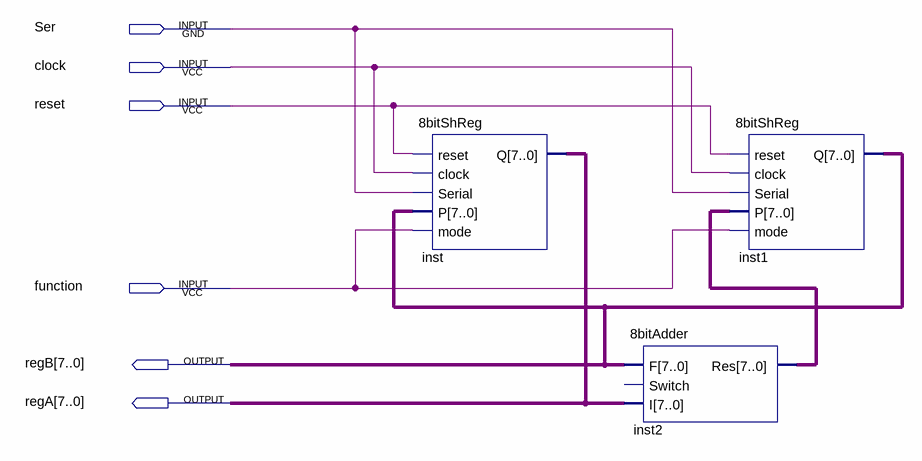
[diagram p0: schematic sheet]
// Quartus schematic Lab3.bdf as structural Verilog: 3 symbols, 6 pins
module Lab3 (
  input  Ser,
  input  clock,
  input  reset,
  input  \function ,
  output [7:0] regB,
  output [7:0] regA
);

  wire [7:0] inst2_res;

  \8bitShReg  inst (.reset(reset), .clock(clock), .Serial(Ser), .P(regB), .mode(\function ), .Q(regA));
  \8bitAdder  inst2 (.F(regB), .I(regA), .Res(inst2_res));  // open: Switch
  \8bitShReg  inst1 (.reset(reset), .clock(clock), .Serial(Ser), .P(inst2_res), .mode(\function ), .Q(regB));
endmodule
